# Altium schematic sheet esquematic_fisica.SchDoc
size A4
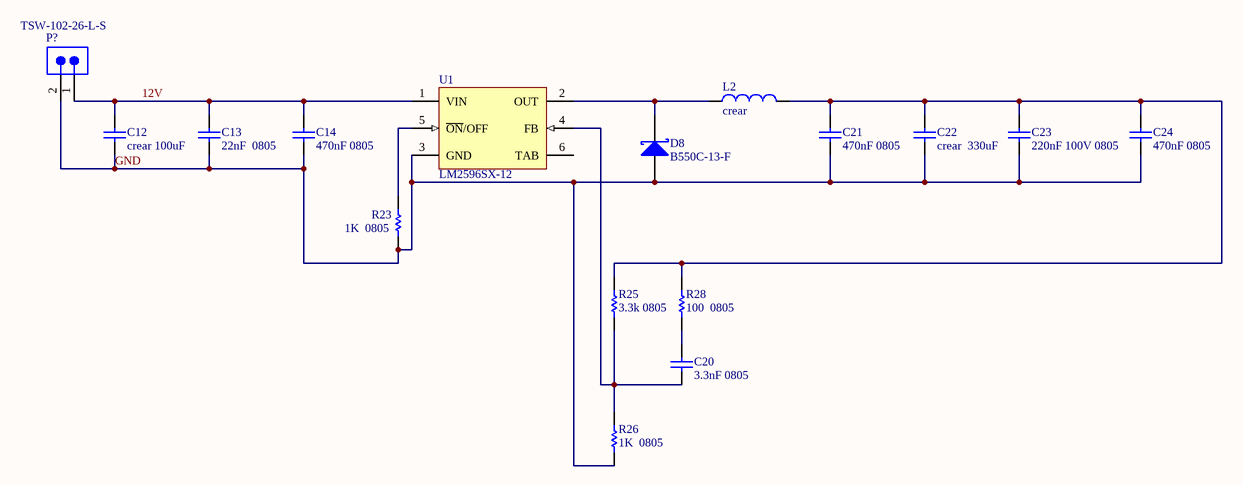
[diagram p0: esquematic_fisica.SchDoc]

## Parts
C12  crear 100uF  [CAPC2013X145X45LL20T25]
C13  22nF  0805  [CAPC0805(2012)100_L]
C14  470nF 0805  [CAPC0805(2012)100_L]
C20  3.3nF 0805  [CAPC0805(2012)100_N]
C21  470nF 0805  [CAPC0805(2012)100_L]
C22  crear  330uF  [CAPC2013X145X45LL20T25]
C23  220nF 100V 0805  [CAPC0805(2012)75_N]
C24  470nF 0805  [CAPC0805(2012)100_L]
D8  B550C-13-F  [DIOD-SMC-2-A_V]
L2  crear  [COIL-RFB1010-2_V]
P?  TSW-102-26-L-S  [SMTC-TSW-102-26-XX-S]
R23  1K  0805  [RESC0805(2012)_M]
R25  3.3k 0805  [RESC2013X60X35ML10T20]
R26  1K  0805  [RESC0805(2012)_M]
R28  100  0805  [RESC0805(2012)_M]
U1  LM2596SX-12  [TS5B_L]

## Nets
12V: C12.2 C13.2 C14.2 P?.1 U1.1(VIN)
GND: C12.1 C13.1 C14.1 C21.1 C22.1 C23.1 C24.1 D8.1(A) P?.2 R23.1 R26.1 U1.3(GND)
NetC20_1: C20.1 R25.1 R26.2 U1.4(FB)
NetC20_2: C20.2 R28.1
NetC21_2: C21.2 C22.2 C23.2 C24.2 L2.2 R25.2 R28.2
NetD8_2: D8.2(K) L2.1 U1.2(OUT)
NetR23_2: R23.2 U1.5(~{ON}/OFF)

Not connected (* = marked no-connect by the designer): U1 6(TAB)

## Library data of the parts
C12 = CMP-2000-07599-1: Chip Capacitor, 100 uF, +/- 20%, 6.3 V, -55 to 85 degC, 0805 (2012 Metric), RoHS, Tape and Reel; Manufacturer: Murata; Voltage Rating (DC): 6.3V; Dielectric: X5R; RoHSCompliant: True; Case Code (Metric): 2012; Manufacturer URL: http://www.murata.com/; Length: 0.079inch; Mounting Technology: SurfaceMount; Datasheet URL: http://search.murata.co.jp/Ceramy/image/img/A01X/G101/ENG/GRM21BR60J107ME15-01.pdf; Max Operating Temperature: 85degC; Thickness: 0.057inch; Capacitance: 100uF; REACH SVHC: NoSVHC; Case Code (Imperial): 0805; Voltage Rating: 6.3V; Case/Package: 0805; Lead Free: LeadFree; Datasheet Version: 03/2016; Min Operating Temperature: -55degC; Package Reference: 805; Mount: SurfaceMount; Tolerance: 20%; Width: 0.049inch; Packaging: CutTape; Package Description: 2-Pin Surface Mount Device, Body 2 x 1.25 mm
C13 = CMP-1036-04079-1: CAP 22nF 100V ±20% 0805 (2012 Metric) Thickness 1mm SMD; Case-EIA: 0805; Case-Metric: 2012; Tolerance: Â±20%; Max Thickness: 1 mm; Value: 22nF; Technology: SMT; Rated Voltage: 100 V
C14 C21 C24 = CMP-1036-04734-1: CAP 1uF 6.3V ±20% 0805 (2012 Metric) Thickness 1mm SMD; Tolerance: Â±20%; Case-Metric: 2012; Case-EIA: 0805; Max Thickness: 1 mm; Technology: SMT; Rated Voltage: 6.3 V; Value: 1uF
C20 = CMP-1036-03429-1: CAP 3.3nF 100V ±1% 0805 (2012 Metric) Thickness 1mm SMD; Tolerance: Â±1%; Case-EIA: 0805; Case-Metric: 2012; Technology: SMT; Value: 3.3nF; Max Thickness: 1 mm; Rated Voltage: 100 V
C22 = CMP-2000-07599-1: Chip Capacitor, 100 uF, +/- 20%, 6.3 V, -55 to 85 degC, 0805 (2012 Metric), RoHS, Tape and Reel; Manufacturer: Murata; Voltage Rating (DC): 6.3V; Capacitance: 100uF; Dielectric: X5R; RoHSCompliant: True; Case Code (Metric): 2012; Manufacturer URL: http://www.murata.com/; Length: 0.079inch; Mounting Technology: SurfaceMount; Datasheet URL: http://search.murata.co.jp/Ceramy/image/img/A01X/G101/ENG/GRM21BR60J107ME15-01.pdf; Max Operating Temperature: 85degC; Thickness: 0.057inch; REACH SVHC: NoSVHC; Case Code (Imperial): 0805; Voltage Rating: 6.3V; Case/Package: 0805; Lead Free: LeadFree; Datasheet Version: 03/2016; Min Operating Temperature: -55degC; Package Reference: 805; Mount: SurfaceMount; Tolerance: 20%; Width: 0.049inch; Packaging: CutTape; Package Description: 2-Pin Surface Mount Device, Body 2 x 1.25 mm
C23 = CMP-1036-04526-1: CAP 220nF 10V ±20% 0805 (2012 Metric) Thickness 0.75mm SMD; Tolerance: Â±20%; Case-EIA: 0805; Case-Metric: 2012; Rated Voltage: 10 V; Max Thickness: 0.75 mm; Technology: SMT; Value: 220nF
D8 = CMP-2000-05906-1: Schottky Barrier Rectifier / , 50 V, 5 A, -55 to 150 degC, 2-Pin SMD, RoHS, Tape and Reel; Unit Weight: 0.007408oz; Configuration: Single; Vrrm - Repetitive Reverse Voltage: 50V; Vf - Forward Voltage: 0.7V; If - Forward Current: 5A; Brand: DiodesIncorporated; Ifsm - Forward Surge Current: 100A; Ir - Reverse Current: 500uA; Datasheet URL: http://www.diodes.com/_files/datasheets/ds13012.pdf; Package Description: 2-Pin Surface Mount Device, Body 6.855 x 5.905 mm; Length: 7.11mm; Operating Temperature Range: -55Cto+125C; Series: B550; Mounting Style: SMD/SMT; Termination Style: SMD/SMT; Factory Pack Quantity: 3000; Packaging: Reel; Minimum Operating Temperature: -55C; Mounting Technology: SurfaceMount; RoHS: True; Manufacturer URL: http://www.diodes.com/; Width: 6.22mm; Technology: Si; Maximum Operating Temperature: +125C; Product Category: SchottkyDiodes&Rectifiers; Height: 2.5mm; Datasheet Version: Rev. 17-2, 07/2015; Package Reference: SMC; Product: SchottkyDiodes; Type: SchottkyBarrierRectifier; Manufacturer: DiodesIncorporated; Package / Case: SMC
L2 = CMP-0899-00031-1: Power Inductor, 470 uH +/- 10%, 0.9 A, -40 to 125 degC, 2-Pin Radial Leaded, Dia 11 mm, RoHS, Tray; PartNumber: RFB1010-471L; Manufacturer: Coilcraft; Irms: 1.2 A @40 degC; SRF: 3 MHz; Isat: 0.9 A; DCR: 0.81 Ohm Max.; Inductance: 470 uH; Ambient Temperature Range: -40 to 125 degC; Tolerance: 10%; Packing: Tray; DatasheetVersion: Sep-13; ComponentLink1URL: http://www.coilcraft.com/; Mounting Technology: Through Hole; RoHS: TRUE; ComponentLink2Description: Datasheet; PackageReference: RFB1010-2; ComponentLink1Description: Manufacturer URL; ComponentLink2URL: http://www.coilcraft.com/pdfs/rfb.pdf; PackageDescription: 2-Pin Radial Leaded, Dia 11 mm, Height 11.5 mm, Radial 6 mm
P? = CMP-1024-00330-1: 0.025" SQ Post Header, Through-hole, Vertical, -55 to 125 degC, 2.54 mm Pitch, 2-Pin, Male, RoHS; Manufacturer: Samtec; Pitch: 2.54 mm; DatasheetVersion: F-214; PackageReference: TSW-102-26-XX-S; ComponentLink3Description: Package Specification; PackageDescription: .025[0.64] SQ. Post Terminal Strip Assembly; PackageVersion: DM, 8/1988; ComponentLink1Description: Manufacturer URL; ComponentLink2URL: http://www.samtec.com/documents/webfiles/pdf/TSW_TH.PDF; ComponentLink3URL: http://www.samtec.com/documents/webfiles/cpdf/TSW-XXX-XX-XXX-X-XX-XXX-MKT.pdf; ComponentLink2Description: Datasheet; Temperature Range: -55 to 125 degC; Mounting Technology: Through-hole; ComponentLink1URL: http://www.samtec.com; RoHS: True; PartNumber: TSW-102-26-L-S; Orientation: Vertical
R23 R26 R28 = CMP-1013-00536-1: 1K78 0.125W 1% 0805 (2012 Metric)  SMD; Value: 1780.00 Ohm; Case-EIA: 0805; Case-Metric: 2012; Tolerance: 1 %; Power: 0.125 W; Technology: SMT
R25 = CMP-2100-03672-1: Chip Resistor, 3.3 KOhm, +/- 1%, 0.125 W, -55 to 155 degC, 0805 (2012 Metric), RoHS, Tape and Reel; Manufacturer: Yageo; Voltage Rating: 150V; Max Power Dissipation: 125mW; Temperature Coefficient: 100ppm/degreesC; Package Quantity: 1; Max Operating Temperature: 155degC; Case Code (Metric): 2012; Package Reference: 0805; Resistance: 3.3KOhm; Composition: ThickFilm; RoHSCompliant: true; Case/Package: 0805; Case Code (Imperial): 0805; Tolerance: 1%; Depth: 1.25mm; Weight: 0.000194oz; Lead Free: LeadFree; Min Operating Temperature: -55degC; Termination: SMD/SMT; Datasheet Version: Rev. 5, 10/2016; REACH SVHC: NoSVHC; Power Rating: 125mW; Packaging: TapeandReel; Number of Terminations: 2; Width: 0.049inch; Package Description: 2-Pin Surface Mounted Device, Body 2 x 1.25 mm; Datasheet URL: http://www.yageo.com/NewPortal/yageodocoutput?fileName=/pdf/R-Chip/PYu-RC_Group_51_RoHS_L_5.pdf; Height: 0.5mm; Length: 2mm; Manufacturer URL: http://www.yageo.com/
U1 = CMP-0069-00277-2: SIMPLE SWITCHER® Power Converter 150 KHz 3A Step-Down Voltage Regulator, 5-pin TO-263; Manufacturer: National Semiconductor; PowerWise: N; PackageTopMarking: NSUZXYTTE#*LM2596S*-12 P+; CompType: Switcher; PackageReference: TS5B; ComponentLink1URL: http://www.national.com/ds/LM/LM2596.pdf; Code_JEDEC: MO-169-AB; ComponentLink2URL: http://www.national.com/pf/LM/LM2596.html; RoHS: N; ComponentLink3URL: http://www.national.com/packaging/folders/ts5b.html; RevisionNote: Component URLs added; ComponentLink2Description: LM2596 Web Page; PinCount: 5; PackageVersion: revD, Apr-2005; ComponentLink3Description: TS5B Package Page; PackageDescription: TO-263, Molded, .400 x .390 x .180in, 5 Lead, .067in Pitch, Surface Mount; ComponentLink1Description: LM2596 Datasheet; DatasheetVersion: May-2002